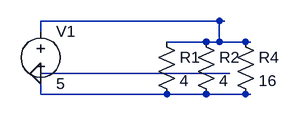
[diagram p0: schematic code.asc]
code.asc, the LTspice schematic file:
Version 4.1
SHEET 1 880 680
WIRE 352 112 80 112
WIRE 360 112 352 112
WIRE 80 128 80 112
WIRE 332 144 272 144
WIRE 352 144 352 112
WIRE 352 144 332 144
WIRE 392 144 352 144
WIRE 400 144 392 144
WIRE 368 192 80 192
WIRE 80 224 80 208
WIRE 272 224 80 224
WIRE 332 224 272 224
WIRE 392 224 332 224
WIRE 400 224 392 224
FLAG 80 192 0
SYMBOL voltage 80 112 R0
SYMATTR InstName V1
SYMATTR Value 5
SYMBOL res 256 128 R0
SYMATTR InstName R1
SYMATTR Value 4
SYMBOL res 316 128 R0
SYMATTR InstName R2
SYMATTR Value 4
SYMBOL res 376 128 R0
SYMATTR InstName R4
SYMATTR Value 16

The netlist it stands for:
* code.asc
V1 N001 N002 5
R1 N001 N002 4
R2 N001 N002 4
R4 N001 N002 16
.backanno
.end